# Altium project solar_pendulum.PrjPcb
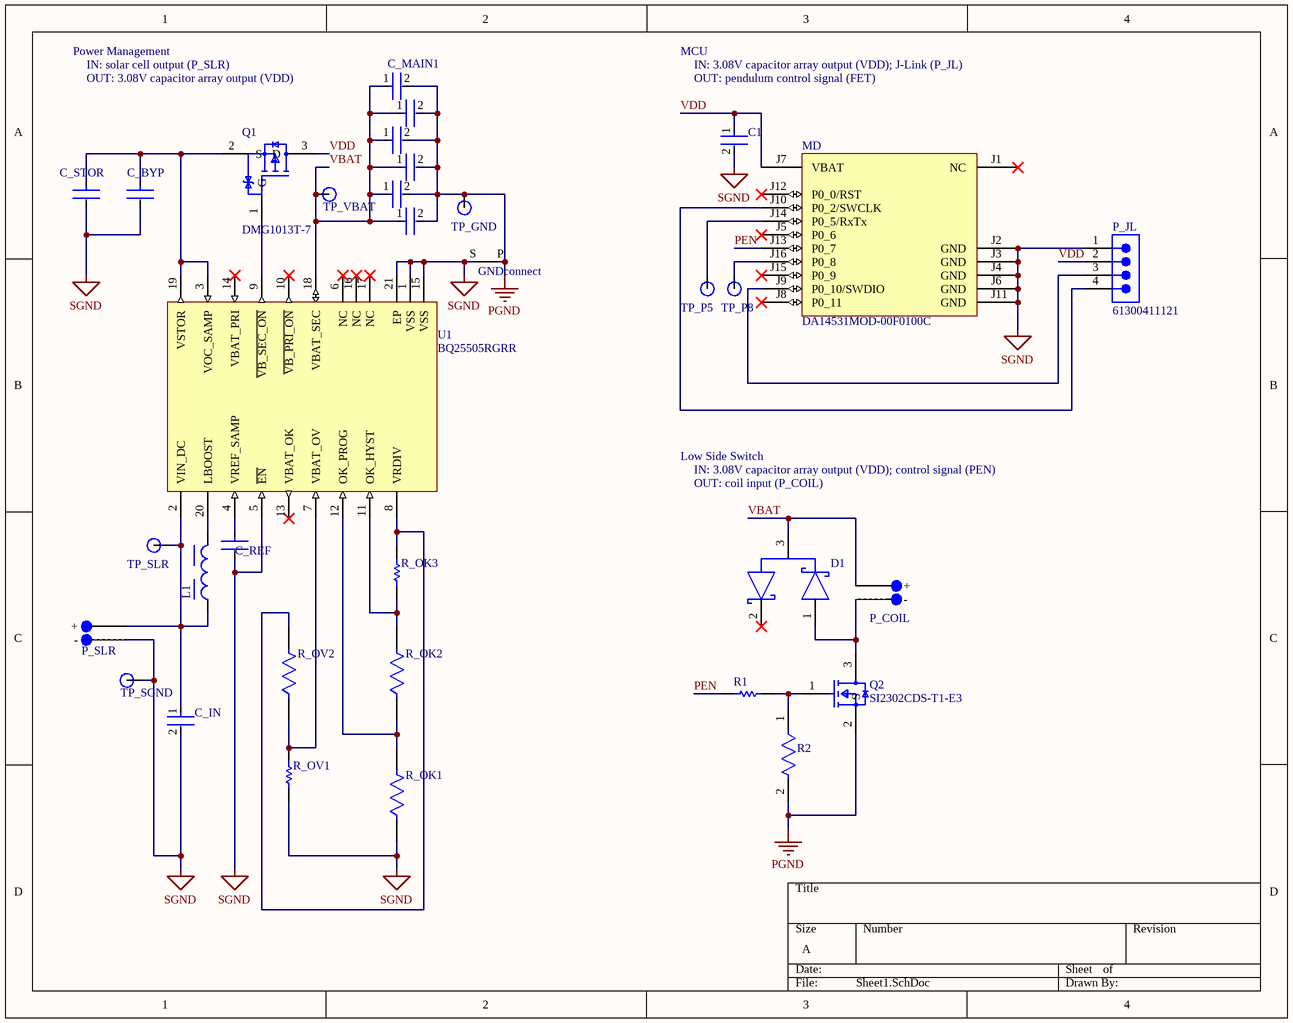
[diagram p0: Sheet1.SchDoc]
1 sheet, 34 parts. Net scope: global (net labels, ports and power ports of the same name join across sheets).
Board file: PCB1.PcbDoc

## Sheet Sheet1.SchDoc
size A; SheetNumber: 1; SheetTotal: 1

### Parts
C1  GRM188R72A104KA35D  [FP-GRM188-0_1-e0_2_0_5-IPC_B]  (value not drawn)
C_BYP  CGA4J1X7R1H475K125AC  [FP-CGA4J-IPC_C]  (value not drawn)
C_IN  CGA4J1X7R1H475K125AC  [FP-CGA4J-IPC_C]  (value not drawn)
C_MAIN1  GRM32ER60J227ME05L  [FP-GRM32E-0_3-MFG]  (value not drawn)
C_MAIN2  GRM32ER60J227ME05L  [FP-GRM32E-0_3-MFG]  (value not drawn)
C_MAIN3  GRM32ER60J227ME05L  [FP-GRM32E-0_3-MFG]  (value not drawn)
C_MAIN4  GRM32ER60J227ME05L  [FP-GRM32E-0_3-MFG]  (value not drawn)
C_MAIN5  GRM32ER60J227ME05L  [FP-GRM32E-0_3-MFG]  (value not drawn)
C_MAIN6  GRM32ER60J227ME05L  [FP-GRM32E-0_3-MFG]  (value not drawn)
C_REF  GCM188R72A103KA37D  [FP-GCM188-0_1-MFG]  (value not drawn)
C_STOR  GCM188R72A103KA37D  [FP-GCM188-0_1-MFG]  (value not drawn)
D1  BAT54STA  [FP-SOT523-MFG]  (value not drawn)
GNDconnect  GNDconnect  [GNDconnect]  (value not drawn)  (net tie, no BOM)
L1  744031220  [WE-TPC_3816]  (value not drawn)
MD  DA14531MOD-00F0100C  [MN0016AA_MFG]
P_COIL  Paired_pads  [Paired_pads]  (value not drawn)
P_JL  61300411121  [61300411121]
P_SLR  Paired_pads  [Paired_pads]  (value not drawn)
Q1  DMG1013T-7  [FP-SOT523-IPC_B]
Q2  SI2302CDS-T1-E3  [FP-S-03946-MFG]
R1  ERJ-3EKF4700V  [RESC1608X55X30ML15T15]  (value not drawn)
R2  RC0603FR-07100KL  [FP-RC0603-0_55-MFG]  (value not drawn)
R_OK1  CRCW06035M62FKEA  [FP-CRCW0603-e3-IPC_B]  (value not drawn)
R_OK2  CRCW06035M49FKEA  [FP-CRCW0603-e3-IPC_C]  (value not drawn)
R_OK3  CRCW06031M87FKEA  [RESC1609X50X30ML10T20]  (value not drawn)
R_OV1  CRCW06037M68FKEA  [RESC0603(1608)_L]  (value not drawn)
R_OV2  CRCW06035M36FKEA  [FP-CRCW0603-e3-IPC_C]  (value not drawn)
TP_GND  TP  [Test_point]  (value not drawn)
TP_P5  TP  [Test_point]  (value not drawn)
TP_P8  TP  [Test_point]  (value not drawn)
TP_SGND  TP  [Test_point]  (value not drawn)
TP_SLR  TP  [Test_point]  (value not drawn)
TP_VBAT  TP  [Test_point]  (value not drawn)
U1  BQ25505RGRR  [RGR0020A_V]

### Nets
PGND: C_MAIN1.2 C_MAIN2.2 C_MAIN3.2 C_MAIN4.2 C_MAIN5.2 C_MAIN6.2 GNDconnect.P Q2.2(S) R2.2 TP_GND.1(TP)
SGND: C1.2 C_BYP.2 C_IN.2 C_REF.2 C_STOR.2 GNDconnect.S MD.J2(GND) MD.J3(GND) MD.J4(GND) MD.J6(GND) MD.J11(GND) P_JL.1 P_SLR.2(-) R_OK1.1 R_OV1.1 TP_SGND.1(TP) U1.1(VSS) U1.5(~{EN}) U1.15(VSS) U1.21(EP)
PEN: MD.J13(P0_7) R1.1
VBAT: C_MAIN1.1 C_MAIN2.1 C_MAIN3.1 C_MAIN4.1 C_MAIN5.1 C_MAIN6.1 D1.3 P_COIL.1(+) TP_VBAT.1(TP) U1.18(VBAT_SEC)
VDD: C1.1 MD.J7(VBAT) P_JL.2 Q1.3(D)
NetC_BYP_1: C_BYP.1 C_STOR.1 Q1.2(S) U1.3(VOC_SAMP) U1.19(VSTOR)
NetC_IN_1: C_IN.1 L1.1 P_SLR.1(+) TP_SLR.1(TP) U1.2(VIN_DC)
NetC_REF_1: C_REF.1 U1.4(VREF_SAMP)
NetD1_1: D1.1 P_COIL.2(-) Q2.3(D)
NetL1_2: L1.2 U1.20(LBOOST)
NetMD_J9: MD.J9(P0_10/SWDIO) P_JL.3
NetMD_J10: MD.J10(P0_2/SWCLK) P_JL.4
NetMD_J14: MD.J14(P0_5/RxTx) TP_P5.1(TP)
NetMD_J16: MD.J16(P0_8) TP_P8.1(TP)
NetQ1_1: Q1.1(G) U1.9(~{VB_SEC_ON})
NetQ2_1: Q2.1(G) R1.2 R2.1
NetR_OK1_2: R_OK1.2 R_OK2.1 U1.12(OK_PROG)
NetR_OK2_2: R_OK2.2 R_OK3.1 U1.11(OK_HYST)
NetR_OK3_2: R_OK3.2 R_OV2.2 U1.8(VRDIV)
NetR_OV1_2: R_OV1.2 R_OV2.1 U1.7(VBAT_OV)

Not connected (* = marked no-connect by the designer): D1 2*; MD J1(NC)* J5(P0_6)* J8(P0_11)* J12(P0_0/RST)* J15(P0_9)*; U1 6(NC)* 10(~{VB_PRI_ON})* 13(VBAT_OK)* 14(VBAT_PRI)* 16(NC)* 17(NC)*

### Notes on the sheet
- Power Management
- OUT: 3.08V capacitor array output (VDD)
- IN: solar cell output (P_SLR)
- MCU
- IN: 3.08V capacitor array output (VDD); J-Link (P_JL)
- (near C1) OUT: pendulum control signal (FET)
- Low Side Switch
- IN: 3.08V capacitor array output (VDD); control signal (PEN)
- OUT: coil input (P_COIL)

### Library data of the parts
C1 = CMP-1035-02595-8: Chip Multilayer Ceramic Capacitors for General Purpose, 0603, 0.10uF, X7R, 15%, 10%, 100V; Capacitance: 100nF; Voltage Rating (DC): 100V; Material: Ceramic; Packaging: Tape and Reel; Dielectric: X7R; Case Code (Imperial): 0603; Package Quantity: 1; Height: 0.8mm; Weight: 0.000222oz; Min Operating Temperature: -55°C; Depth: 0.8mm; Mount: Surface Mount; Thickness: 0.035inch; Voltage: 100V; REACH SVHC: No SVHC; Case/Package: 0603; Voltage Rating: 100V; Width: 0.8mm; Tolerance: 10%; Lead Free: Lead Free; Case Code (Metric): 1608; Radiation Hardening: No; Max Operating Temperature: 125°C; Termination: SMD/SMT; Length: 1.6mm
C_BYP C_IN = CMP-08246-000171-1: Cap Ceramic 4.7uF 50V X7R 10% Pad SMD 0805 +125°C Automotive T/R
C_MAIN1-C_MAIN6 = CMP-06035-024340-1: Chip Multilayer Ceramic Capacitors for General Purpose, 1210, 220uF, X5R, 15%, 20%, 6.3V; Capacitance: 220uF; Length: 3.2mm; Voltage Rating (DC): 6.3V; Width: 2.5mm; Thickness: 2.5mm; Tolerance: 20%; Dielectric: X5R
C_REF C_STOR = CMP-2006-02392-2: Ceramic Capacitor for Automotive 10nF  ±10% 100VDC X7R 0603 Paper T/R; Voltage: 100V; REACH SVHC: No SVHC; Width: 0.8mm; Termination: SMD/SMT; Voltage Rating: 100V; Tolerance: 10%; Depth: 0.8mm; Voltage Rating (DC): 100V; Length: 1.6mm; Lead Free: Lead Free; Radiation Hardening: No; Package Quantity: 1; Height: 0.8mm; Case Code (Imperial): 0603; Max Operating Temperature: 125°C; Case Code (Metric): 1608; Packaging: Tape and Reel; Mount: Surface Mount; Dielectric: X7R; Capacitance: 10nF; Thickness: 0.035inch; Case/Package: 0603; Min Operating Temperature: -55°C; Ratings: AEC-Q200
D1 = CMP-12790-000041-1: DIODE ARRAY SCHOTTKY 30V SOT23-3; Manufacturer: Diodes Inc.; Automotive Grade: Grade 0; Max Surge Forward Current: 600mA; Forward Current: 200mA; Peak Reverse Current: 2uA; Standoff Height: 0mm; Value: 10pF; Max Junction Temp: +150°C; Device Class L3: Schottky Diodes; Temperature Range Low: -65°C; Package: SOT523; Lead Free: Yes; ComponentLink2URL: https://www.diodes.com/assets/Datasheets/ds30259.pdf; Max Repetitive Reverse Voltage: 30V; Octopart: https://octopart.com/bat54sta-diodes+inc.-326178; Digikey Description: DIODE ARRAY SCHOTTKY 30V SOT23-3; Footprint Url: https://www.diodes.com/assets/Package-Files/SOT523.pdf; Category: Diode; Temperature Range High: +150°C; Automotive: Yes; Height: 0.9mm; Reverse Voltage: 30V; Mouser Description: Schottky Diodes & Rectifiers Series 30V 200mA; Temperature: -65°C to +150°C; Manufacturer Part Number: BAT54STA; ComponentLink2Description: Datasheet; RoHS: TRUE; Capacitance: 10pF; Device Class L1: Discrete Semiconductors; Device Class L2: Diodes
L1 = CMP-0227-00346-6: Tiny Power Inductor, SMT, Fixed, 22UH, .51A, .041 Ohm, 3816, We-tpc Series; Manufacturer Lifecycle Status: ACTIVE; DC Resistance (DCR): 410mΩ; Tolerance: 30%; Current Rating: 510mA; Core Material: Ferrite; Inductance: 22µH; Test Frequency: 100kHz; Saturation Current: 360mA; Series Resistance: 450mΩ; Self Resonant Frequency: 26MHz; Max Operating Temperature: 125°C; Number of Pins: 2; Lifecycle Status: Production; Length: 3.8mm; Composition: Wirewound; Height: 1.65mm; Ambient Temperature Range Low: -40°C; Width: 3.8mm; RMS Current (Irms): 510mA; Min Operating Temperature: -40°C; Inductance Tolerance: 30%; RoHS: Compliant; Ambient Temperature Range High: 95°C
MD = CMP-00572-135729375-1: SmartBond TINY Bluetooth Low Energy Module; Manufacturer Lifecycle Status: ACTIVE; Pitch: 1.5mm; Min Supply Voltage: 1.65V; Max Supply Voltage: 3.6V; Nominal Supply Voltage (DC): 3V; Composition: Hybrid; HelpURL: https://octopart.com/cad-content/api/get-model-datasheet/15189/135729375; Length: 14.5mm; Case/Package: Module; Packaging: Tape & Reel; Min Operating Temperature: -40°C; Lifecycle Status: Production; RoHS: Compliant; Number of Pins: 15; Part Family: DA14531MOD; ComponentLink3Description: Manufacturer's Package Drawing; MSL: 3; Max Operating Temperature: 85°C; ComponentLink2Description: Datasheet URL; REACH SVHC: Yes; Export Control Classification Number (ECCN) Code: EAR99; ComponentLink2URL: https://octopart.com/cad-content/api/get-model-datasheet/15189/135729375; ComponentLink1Description: Manufacturer's Website; Introduction Date: 2020-06-26; Terminal Pitch: 1.5mm; Package Quantity: 300; ComponentLink1URL: http://www.renesas.com; Height - Seated (Max): 3.05mm; Harmonized Tariff Schedule (HTS) Code: 8542.39.90; Width: 12.5mm; ComponentLink3URL: https://www.renesas.com/en/document/psc/mn0016aa-16-mod-125-x-145-x-28-mm-body-15mm-pitch-psc-5005-01; Number of Terminals: 16
P_JL = CMP-1502-01064-4: THT Vertical Pin Header WR-PHD, Pitch 2.54 mm, Single Row, 4 pins; Connector Type: Male Pin; Gender: Male; Current Rating: 3A; Number of Positions: 4; Operating Supply Voltage: 250V; Contact Resistance: 20mΩ; Pitch: 2.54mm; Max Operating Temperature: 105°C; Mount: Through Hole; Contact Material: Gold; Contact Plating: Gold; Number of Contacts: 4; Orientation: Vertical; Packaging: Bulk; Contact Mating Length: 5.9944mm; Voltage Rating: 250V; Number of Rows: 1; Height: 8.89mm; Lead Free: Lead Free; Lead Pitch: 2.54mm; Number of Pins: 4; Color: Black; Min Operating Temperature: -40°C; RoHS: Compliant; Termination: Solder
Q1 = CMP-12801-000011-2: MOSFET P-CH 20V 0.46A SOT-523; Threshold Voltage: -1V; Continuous Drain Current (ID): 460mA; Rise Time: 8.1ns; Turn-Off Delay Time: 28.4ns; Number of Channels: 1; On-State Resistance: 700mR; Power Dissipation: 270mW; Input Capacitance: 59.76pF; Fall Time: 20.7ns; Turn-On Delay Time: 5.1ns; Drain to Source Resistance: 1R; Drain to Source Breakdown Voltage: -20V; Gate to Source Voltage (Vgs): 6V; Element Configuration: Single; Min Operating Temperature: -55°C; Max Operating Temperature: 150°C; Case/Package: SOT-523; Lead Free: Lead Free; Length: 1.7mm; REACH SVHC: No SVHC; Radiation Hardening: No; Number of Pins: 3; Weight: 7.1E-05oz; Rds On Max: 700mR; Height: 0.8mm; Number of Elements: 1; Packaging: Tape and Reel; Mount: Surface Mount; Width: 0.85mm; Drain to Source Voltage (Vdss): 20V; Max Power Dissipation: 270mW; Contact Plating: Tin; Package Quantity: 1
Q2 = CMP-02550-000184-1: MOSFET N-CH 20V 2.6A SOT-23; Manufacturer: Vishay; Gate To Source Voltage: 8V; Max Forward Diode Voltage: 1.2V; Pulse Drain Current: 10A; Typ Forward Diode Voltage: 0.7V; Number Of N Channels: 1; Reverse Recovery Charge: 2nC; Power Dissipation: 0.71W; Reverse Recovery Time: 8.5ns; Threshold Vgs Min: 0.4V; Drain To Source Resistance: 0.045Ω; Gate Charge At Vgs: 3.5nC @ 4.5V; Turn Off Delay Time: 30ns; Rthja Max: 140°C/W; Max Junction Temp: +150°C; Transconductance: 13S; Depletion Mode: False; Standoff Height: 0.01mm; Turn On Delay Time: 8ns; Threshold Vgs Max: 0.85V; Manufacturer Part Number: SI2302CDS-T1-E3; Mouser Description: MOSFET 20V 2.9A 0.86W 57mohm @ 4.5V; Digikey Description: MOSFET N-CH 20V 2.6A SOT-23; Drain To Source Voltage: 20V; Lead Free: Yes; Temperature Range High: +150°C; Automotive: No; ComponentLink2URL: http://www.vishay.com/docs/68645/si2302cds.pdf; Height: 1.12mm; ComponentLink2Description: Datasheet; Octopart: https://octopart.com/si2302cds-t1-e3-vishay-44452855; Continuous Drain Current: 2.6A; Drain To Source Breakdown Voltage: 20V; Number Of Channels: 1; Device Class L3: MOSFETs; Device Class L1: Discrete Semiconductors; Temperature Range Low: -55°C; Package: S-03946; RoHS: TRUE; Device Class L2: Transistors; Temperature: -55°C to +150°C; Category: Trans
R1 = CMP-1012-00473-6: Chip Resistor, 470 Ohm, +/- 1%, 0.1 W, -55 to 155 degC, 0603 (1608 Metric), RoHS, Tape and Reel; Manufacturer: Panasonic; Voltage Rating: 75 V; Height: 0.45 mm; ComponentLink1Description: Manufacturer URL; Packaging: Tape and Reel; Max Operating Temperature: 155 degC; ComponentLink3Description: Package Specification; ComponentLink3URL: https://datasheet.ciiva.com/11808/0900766b80f806dd-11808207.pdf; ComponentLink2Description: Datasheet; RoHSCompliant: true; ComponentLink1URL: http://www.panasonic.com/; Min Operating Temperature: -55 degC; PackageReference: 0603; DatasheetVersion: 04/2015; REACH SVHC: Yes; Length: 1.6 mm; Mount: Surface Mount; Mounting Technology: Surface Mount; Pins: 2; ComponentLink2URL: http://industrial.panasonic.com/cdbs/www-data/pdf/RDA0000/AOA0000C86.pdf; PackageDescription: 2-Pin Surface Mount Device, Body 1.6 x 0.85 mm; Package Quantity: 1
R2 = CMP-2100-03662-2: RES SMD 100K OHM 1% 1/10W 0603; Voltage Rating (DC): 50V; Resistance: 100kR; Max Power Dissipation: 100mW; Temperature Coefficient: 100ppm/°C; Working Voltage: 75V; Length: 1.6mm; Lead Free: Lead Free; Number of Terminations: 2; Packaging: Tape and Reel; Voltage Rating: 50V; Termination: SMD/SMT; Width: 0.8mm; Resistor Type: Thick Film; Resistance Tolerance: 1%; Features: Moisture Resistant; Height: 0.45mm; Construction: Rectangular; Case/Package: 0603; Military Standard: Not; Case Code (Imperial): 0603; Series: RC; Technology: THICK FILM; Depth: 0.8mm; RoHS Compliant: Yes; REACH SVHC: No SVHC; Min Operating Temperature: -55°C; Case Code (Metric): 1608; Max Operating Temperature: 155°C; Power Rating: 100mW; Number of Pins: 2; Tolerance: 1%
R_OK1 = CMP-02407-011800-1: RES Thick Film, 5.62MΩ, 1%, 0.1W, 100ppm/°C, 0603; Max Power Dissipation: 100mW; Resistance: 5.62MR; Voltage Rating (DC): 75V; Contact Plating: Tin; Temperature Coefficient: 100ppm/°C; Max Operating Temperature: 155°C; Case Code (Imperial): 0603; Width: 0.033inch; Depth: 0.85mm; Military Standard: Not; Lead Free: Lead Free; Length: 1.55mm; Features: Automotive AEC-Q200; Resistor Type: Thick Film; Case/Package: 0603; Construction: Rectangular; Number of Pins: 2; Power Rating: 100mW; Series: CRCW; Height: 0.02inch; Min Operating Temperature: -55°C; Case Code (Metric): 1608; Package Quantity: 10; RoHS Compliant: Yes; Packaging: Tape and Reel; Voltage Rating: 75V; Weight: 7.1E-05oz; Number of Terminations: 2; Resistance Tolerance: 1%; Tolerance: 1%
R_OK2 = CMP-02407-002627-1: RES Thick Film, 5.49MΩ, 1%, 0.1W, 100ppm/°C, 0603; Resistance: 5.49MR; Voltage Rating: 75V; Power Rating: 100mW; Temperature Coefficient: 100ppm/°C; Radiation Hardening: No; Termination: SMD/SMT; Case Code (Metric): 1608; Min Operating Temperature: -55°C; Case/Package: 0603; Composition: Thick Film; Lead Free: Lead Free; Voltage Rating (DC): 75V; Width: 0.033inch; Length: 1.55mm; Package Quantity: 10; Packaging: Tape and Reel; Max Power Dissipation: 100mW; Weight: 7.1E-05oz; Tolerance: 1%; Depth: 0.85mm; Case Code (Imperial): 0603; Number of Pins: 2; Height: 0.02inch; Features: Automotive AEC-Q200; Military Standard: Not; Max Operating Temperature: 155°C; Contact Plating: Tin; Number of Terminations: 2
R_OK3 = CMP-1012-00878-2: Manufacturer: Vishay Dale; Part Number: CRCW06031M87FKEA
R_OV1 = CMP-1012-00949-1: 7M68 0.1W 1% 0603 (1608 Metric)  SMD; Case-Metric: 1608; Case-EIA: 0603; Value: 7680000.00 Ohm; Technology: SMT; Power: 0.1 W; Tolerance: 1 %
R_OV2 = CMP-02407-008561-1: RES Thick Film, 5.36MΩ, 1%, 0.1W, 100ppm/°C, 0603; Resistance: 5.36MR; Voltage Rating (DC): 75V; Power Rating: 100mW; Package Quantity: 10; Case Code (Metric): 1608; Weight: 7.1E-05oz; Composition: Thick Film; Tolerance: 1%; Case Code (Imperial): 0603; Number of Pins: 2; Temperature Coefficient: 100ppm/°C; Min Operating Temperature: -55°C; Depth: 0.85mm; Length: 1.55mm; Case/Package: 0603; Max Operating Temperature: 155°C; Lead Free: Lead Free; Number of Terminations: 2; Military Standard: Not; Width: 0.033inch; Packaging: Tape and Reel; Contact Plating: Tin; Max Power Dissipation: 100mW; Features: Automotive AEC-Q200; Voltage Rating: 75V; Height: 0.02inch
U1 = CMP-0393-00016-1: Ultra Low-Power Boost Charger with Battery Management and Autonomous Power Multiplexer for Primary Battery in Energy Harvester Applications, 0.1 to 5.1 V, -40 to 85 degC, 20-Pin VQFN (RGR), Green (RoHS & no Sb/Br), Tape and Reel; VIN Min: 0.1 V; VIN Max: 5.1 V; Temperature Max: 85 degC; Generic Part Number: BQ25505; ComponentLink3Description: Package Specification; ComponentLink1URL: http://www.ti.com/; PartNumber: BQ25505RGRR; ComponentLink2URL: http://www.ti.com/lit/ds/symlink/bq25505.pdf; ComponentLink3URL: http://www.ti.com/lit/ml/mpqf239/mpqf239.pdf; Temperature Min: -40 degC; ComponentLink1Description: Manufacturer URL; Mounting Technology: Surface Mount; DatasheetVersion: SLUSBJ3D; Packing: Tape and Reel; PackageDescription: 20-Pin Plastic Quad Flatpack No-Lead, Body 3.5 x 3.5 mm, Pitch 0.5 mm; PackageVersion: 4210217/A, 04/2009; ComponentLink2Description: Datasheet; RoHS: TRUE